# EasyEDA Pro project BioWatch_PCB-DESKTOP-TT52GDR.eprj, board PCB_3
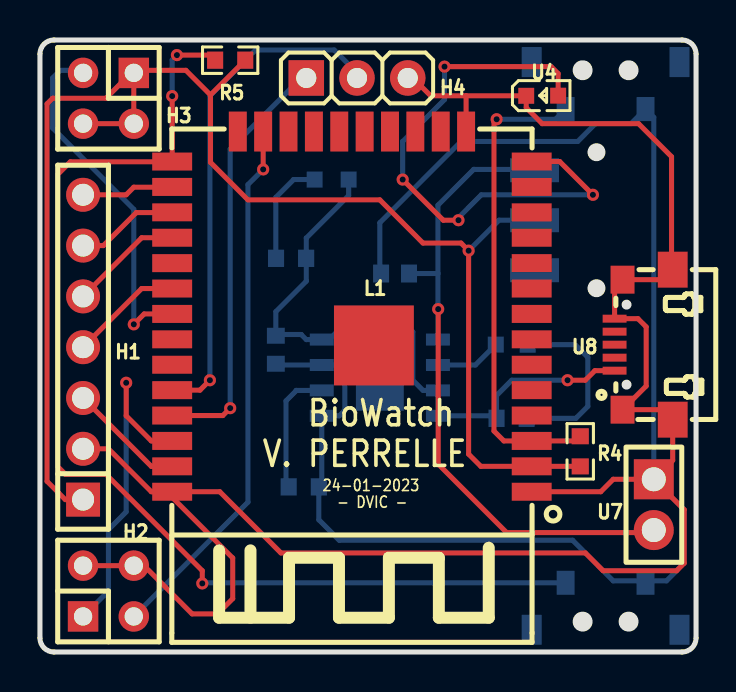
[diagram p7: board, top side]
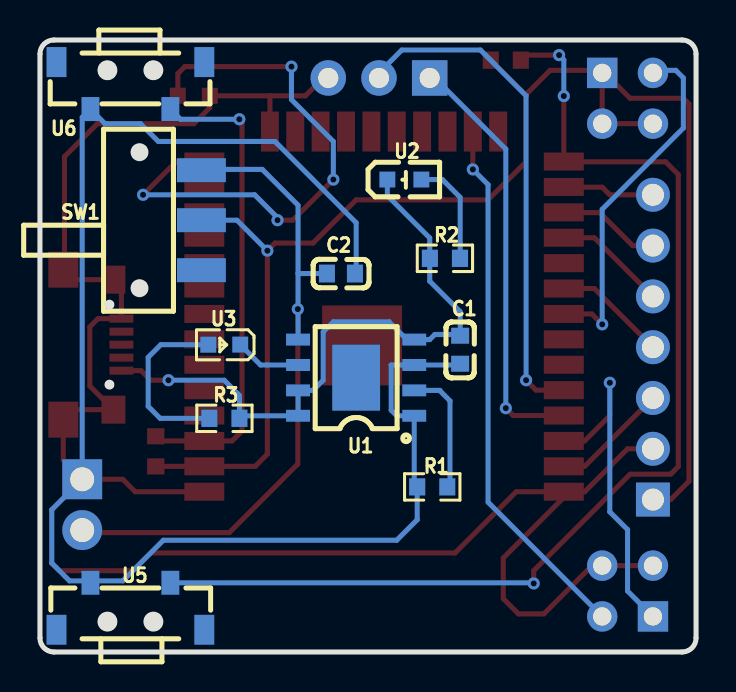
[diagram p8: board, bottom side, seen from below]

Outline 32.85 x 30.6 mm; copper layers: Top Layer, Bottom Layer. Coordinates in mm from the lower left corner of the outline.
Outline path: 0,29.9 0,0.7 arc(0.21,0.21) 0.7,0 32.15,0 arc(32.64,0.21) 32.85,0.7 32.85,29.9 arc(32.64,30.39) 32.15,30.6 0.7,30.6 arc(0.21,30.39) 0,29.9
Stack: Top Layer 0.035mm / Dielectric1 1.51mm FR4 er 4.5 / Bottom Layer 0.035mm

## Design rules (mm)
spacing Default (default): track to track 0.152, other pairs 0 to 0.254
track width Default (default): min 0.254, default 0.254, max 25.4
differential pair differentialPair (default): width min 0.127, default 0.254, max 2.54; gap min 0.152, default 0.152
via Default (default): diameter min 0.61, default 0.61, max 100.025; hole min 0.305, default 0.305, max 59.995

## Placement (name value [footprint] x y rotation side)
C1  CAPCER0.1UF16VX5R0603,CAPCER0.1UF25VX5R0603,CAPCER0.1UF16VX7R0603  [C0603]  11.81 15.11 90 bottom
C2  10uF  [C0603]  17.78 18.92 0 bottom
H1  PZ254V-11-07P  [HDR-TH_7P-P2.54-V-M]  2.16 15.24 90 top
H2  B-2100S04P-B110  [HDR-TH_4P-P2.54-V-M-R2-C2-S2.54-1]  3.43 3.05 0 top
H3  B-2100S04P-B110  [HDR-TH_4P-P2.54-V-M-R2-C2-S2.54-1]  3.43 27.69 180 top
H4  H7: header 1x3 programmation serial  [HEADER3L]  13.33 28.7 0 top
L1  ESP32-S32MB  [WIFIM-SMD_ESP32-S32MB]  15.62 17.02 180 top
R1  1.2kΩ  [R0603]  13.21 8.26 180 bottom
R2  1kΩ  [R0603]  12.57 19.69 0 bottom
R3  1kΩ  [R0603]  23.61 11.68 180 bottom
R4  10kΩ  [R0603]  27.05 10.03 270 top
R5  10kΩ  [R0603]  9.52 29.59 180 top
SW1  TA-3525-A3  [SW-SMD_3P-L9.1-W3.5-P2.50-EH6.8]  24.76 21.59 270 bottom
U1  TP4056_C382139  [ESOP-8_L4.9-W3.9-P1.27-LS6.0-BL-EP]  17.02 13.72 90 bottom
U2  LED0603R  [LED0603-R-RD]  14.6 23.62 180 bottom
U3  LED0603B  [LED0603-RD]  23.62 15.37 0 bottom
U4  LED0603B  [LED0603-RD]  25.15 27.81 0 top
U5  BUTTON1  [SW-SMD_L7.8-W3.5-P4.00-EH]  28.32 2.29 0 bottom
U6  BUTTON2  [SW-SMD_L7.8-W3.5-P4.00-EH]  28.32 28.32 180 bottom
U7  DM254R-11-02-85  [HDR-TH_2P-P2.54-V-F]  30.73 7.37 270 top
U8  USB-MICRO-5P  [MICRO-USB-SMD_MICRO-USB-A9]  30.23 15.37 90 top

## Footprints (pads in the part's own frame, mm; a bottom-side part is the same pattern mirrored in y, then rotated)
C0603
  rect 0.8x0.9 smd: 1(-0.7,0) 2(0.7,0)
ESOP-8_L4.9-W3.9-P1.27-LS6.0-BL-EP
  rect 0.6x1.2 smd: 1(-1.905,-2.909) 2(-0.635,-2.909) 3(0.635,-2.909) 4(1.905,-2.909) 5(1.905,2.909) 6(0.635,2.909) 7(-0.635,2.909) 8(-1.905,2.909)
  rect 3.3x2.4 smd: 9(0,0)
HDR-TH_2P-P2.54-V-F
  rect 2x2 hole 1.2: 1(-1.27,0)
  round 2 hole 1.2: 2(1.27,0)
HDR-TH_4P-P2.54-V-M-R2-C2-S2.54-1
  rect 1.524x1.524 hole 0.914: 1(-1.27,-1.27)
  round 1.524 hole 0.914: 2(-1.27,1.27) 3(1.27,-1.27) 4(1.27,1.27)
HDR-TH_7P-P2.54-V-M
  rect 1.7x1.7 hole 1.1: 1(-7.62,0)
  round 1.7 hole 1.1: 2(-5.08,0) 3(-2.54,0) 4(0,0) 5(2.54,0) 6(5.08,0) 7(7.62,0)
HEADER3L
  rect 1.778x1.778 hole 1.005x1: 1(0,0)
  round 1.778 hole 1.005x1: 2(2.54,0) 3(5.08,0)
LED0603-R-RD
  rect 0.8x0.8 smd: 1(0.851,0) 2(-0.851,0)
LED0603-RD
  rect 0.8x0.8 smd: 1(-0.799,-0.004) 2(0.799,0.004)
MICRO-USB-SMD_MICRO-USB-A9
  rect 0.4x1.2 smd: 1(-1.3,1.455) 2(-0.65,1.455) 3(0,1.455) 4(0.65,1.455) 5(1.3,1.455)
  rect 1.4x1.2 smd: 6(3.25,1.055) 7(-3.25,1.055)
  rect 1.8x1.5 smd: 8(-3.75,-1.455) 9(3.75,-1.455)
R0603
  rect 0.806x0.864 smd: 1(-0.753,0) 2(0.753,0)
SW-SMD_3P-L9.1-W3.5-P2.50-EH6.8
  rect 1.2x2.45 smd: 1(-2.5,0) 2(0,0) 3(2.5,0)
SW-SMD_L7.8-W3.5-P4.00-EH
  rect 0.9x1.2 smd: 1(-2,-1.175) 2(2,-1.175)
  rect 1x1.5 smd: 3(-3.7,1.175) 4(3.7,1.175)
WIFIM-SMD_ESP32-S32MB
  rect 2x0.9 smd: 1(-9,9.005) 2(-9,7.735) 3(-9,6.465) 4(-9,5.195) 5(-9,3.925) 6(-9,2.655) 7(-9,1.385) 8(-9,0.115) 9(-9,-1.155) 10(-9,-2.425) 11(-9,-3.695) 12(-9,-4.965) 13(-9,-6.235) 14(-9,-7.505) 25(9,-7.505) 26(9,-6.235) 27(9,-4.965) 28(9,-3.695) 29(9,-2.425) 30(9,-1.155) 31(9,0.115) 32(9,1.385) 33(9,2.655) 34(9,3.925) 35(9,5.195) 36(9,6.465) 37(9,7.735) 38(9,9.005)
  rect 0.9x2 smd: 15(-5.715,-9.005) 16(-4.445,-9.005) 17(-3.175,-9.005) 18(-1.905,-9.005) 19(-0.635,-9.005) 20(0.635,-9.005) 21(1.905,-9.005) 22(3.175,-9.005) 23(4.445,-9.005) 24(5.715,-9.005)
  rect 4x4 smd: 39(-1.1,1.689)

## Nets
As in the schematic.

Pads without a net: L1 4 5 6 7 8 9 10 11 12 13 16 17 18 19 20 21 22 24 29 32 33 39; SW1 3; U1 9; U5 3 4; U6 3 4; U8 2 3 4

## Via types
v1: diameter 0.61, hole 0.305, Top Layer to Bottom Layer, 16 vias

## Routing (per net, layer and track width the routed paths; a pad name or vN(x,y) marks a point on that pad's centre or on a via; arc(x,y) is an arc through that point)
+5V: length 32.5
  Top Layer w0.254: U8.1 27.78,14.07 27.3,13.59 v1(26.42,13.59)
  Bottom Layer w0.254: U2.2 15.46,22.82 13.33,20.7 13.33,18.54 11.81,17.02 C1.2 ; v1(26.42,13.59) 23.62,13.59 22.86,12.83 R3.2 22.73,11.81 U1.8 U1.7 19.18,13.08 18.67,13.59 18.67,16 18.16,16.51 15.37,16.51 14.48,15.62 U1.4 13.33,15.62 13.08,15.88 12.09,15.88 11.87,15.81
GND: length 173.5
  Top Layer w0.254: 21.34,27.81 19.56,27.81 18.41,28.96 ; 21.34,27.81 L1.15 ; 21.34,27.81 U4.1 24.35,27.22 25.15,26.42 29.97,26.42 31.62,24.77 31.62,19.18 U8.9 31.18,18.62 U8.6 28.77,18.22 U8.5 29.94,16.67 30.35,16.26 30.35,13.3 U8.7 31.18,12.12 U8.8 31.68,9.58 30.73,8.64 ; H1.2 3.43,10.16 5.58,8.01 L1.38 ; L1.38 9,8.01 12.06,4.95 27.3,4.95 28.19,4.06 31.88,4.06 32.26,4.45 32.26,7.11 30.73,8.64 ; L1.38 6.62,7.73 9.65,4.7 9.65,2.67 8.89,1.91 7.62,1.91 5.21,4.32 H2.4 H2.2 ; 30.73,8.64 28.7,8.64 28.08,8.01 L1.1
  Bottom Layer w0.254: C1.1 11.87,14.35 U1.3 15.26,14.35 15.26,12.09 14.99,11.81 U1.1 14.11,8.27 14.1,8.26 R1.1 13.96,6.61 14.99,5.59 26.67,5.59 28.7,3.56 30.23,3.56 U5.2 30.42,3.56 31.37,3.56 32.26,4.45 32.26,7.11 30.73,8.64 30.73,26.73 U6.1 29.59,26.42 27.81,26.42 26.92,25.53 21.08,25.53 17.02,21.46 17.02,18.99 16.95,18.92
VCC: length 76.1
  Top Layer w0.254: 8.54,27.85 8.54,24.48 10.41,22.61 17.02,22.61 19.18,20.45 21.08,20.45 v1(21.46,20.07) 21.46,9.89 22.07,9.28 L1.2 27.05,9.28 R4.2 ; 8.54,27.85 7.31,29.08 4.7,29.08 3.3,27.69 0.63,27.69 0.36,27.41 0.36,8.53 1.27,7.62 H1.1 ; 8.54,27.85 R5.1 ; H3.4 H3.2 H3.1
  Bottom Layer w0.254: SW1.2 22.99,21.59 v1(21.46,20.07)
BAT+: length 33.8
  Top Layer w0.254: U7.2 30.61,5.97 23.37,5.97 19.94,9.4 v1(19.94,17.15)
  Bottom Layer w0.254: 19.93,18.92 C2.2 ; 19.93,18.92 19.93,22.34 21.72,24.13 24.72,24.13 SW1.1 ; 19.93,18.92 U1.5
$2N3160: length 6.4
  Bottom Layer w0.254: R1.2 12.45,8.26 12.32,8.38 12.32,12.56 12.83,13.06 12.83,13.08 U1.2
$2N3161: length 9
  Bottom Layer w0.254: R3.1 26.83,11.68 27.43,12.28 27.43,14.73 26.8,15.37 24.42,15.37 U3.2
$2N3167: length 5.4
  Bottom Layer w0.254: R2.1 11.81,19.69 11.81,22.73 12.7,23.62 U2.1
$2N3169: length 3.3
  Bottom Layer w0.254: U1.6 21.8,14.35 U3.1
$2N3176: length 5.7
  Top Layer w0.254: H1.5 5.09,20.71 L1.28
$2N3180: length 21.4
  Top Layer w0.254: L1.35 9.16,11.82 v1(9.52,12.19)
  Bottom Layer w0.254: v1(9.52,12.19) 9.52,25.15 13.33,28.96
$2N3181: length 25.1
  Top Layer w0.254: L1.34 8.01,13.09 v1(8.51,13.59)
  Bottom Layer w0.254: 15.88,28.96 14.73,30.1 10.79,30.1 8.51,27.81 v1(8.51,13.59)
$2N3182: length 5.9
  Top Layer w0.254: L1.37 5.58,9.28 H1.3
$2N3183: length 5.2
  Top Layer w0.254: L1.27 6.61,21.97 4.83,21.97 3.17,20.32 H1.6
$2N3191: length 23.9
  Top Layer w0.254: v1(22.87,26.64) 22.73,26.5 22.73,11.05 23.23,10.55 L1.3 26.82,10.55 R4.1
  Bottom Layer w0.254: U6.2 25.81,26.64 v1(22.87,26.64)
$2N3194: length 56.3
  Top Layer w0.254: v1(8.13,3.43) 8.13,4.06 3.3,8.89 1.27,8.89 0.89,9.27 0.89,23.88 1.52,24.51 6.6,24.51 6.62,24.52 L1.25 v1(6.62,27.8) 6.6,27.81 ; R5.2 8.52,29.84 v1(6.86,29.84)
  Bottom Layer w0.254: v1(6.86,29.84) 6.62,29.61 v1(6.62,27.8) ; v1(8.13,3.43) 8.16,3.46 U5.1
$2N4014: length 5.7
  Top Layer w0.254: L1.30 5.09,18.17 H1.4
$2N4020: length 26.9
  Top Layer w0.254: v1(11.18,24.13) L1.23
  Bottom Layer w0.254: v1(11.18,24.13) 10.41,23.37 10.41,7.49 H2.3
$2N4222: length 17.8
  Top Layer w0.254: L1.31 5.22,16.9 v1(4.7,16.38)
  Bottom Layer w0.254: v1(4.7,16.38) 4.7,22.13 0.63,26.2 0.63,28.7 1.02,29.08 2.16,29.08
$2N4223: length 4.6
  Top Layer w0.254: H1.7 4.32,22.86 4.7,23.24 6.61,23.24 L1.26
$2N4430: length 17.1
  Top Layer w0.254: L1.36 5.58,10.55 4.32,11.81 v1(4.32,13.46)
  Bottom Layer w0.254: v1(4.32,13.46) 4.32,7.01 3.43,6.12 3.43,3.05 H2.1
$2N6627: length 28.2
  Top Layer w0.254: U4.2 25.95,28.92 25.6,29.27 v1(20.26,29.27) ; v1(18.16,23.62) 20.19,21.59 v1(20.95,21.59) ; v1(27.69,22.86) 26.02,24.52 L1.14
  Bottom Layer w0.254: v1(18.16,23.62) 18.16,25.53 20.26,27.62 v1(20.26,29.27) ; v1(27.69,22.86) 22.1,22.86 20.95,21.72 v1(20.95,21.59)

## Text on the board
Top Silkscreen Layer: 24-01-2023 | - DVIC - | BioWatch / V. PERRELLE
